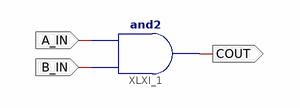
[diagram p0: schematic sheet 1]
// Xilinx ISE schematic and_prj.sch (artix7) as structural Verilog: 1 symbols, 3 ports
module and_prj (
  input  A_IN,
  input  B_IN,
  output COUT
);

  and XLXI_1 (COUT, B_IN, A_IN);
endmodule
